# Altium schematic sheet MODULE_SCH.SchDoc
size A4; SheetNumber: 3; SheetTotal: 3
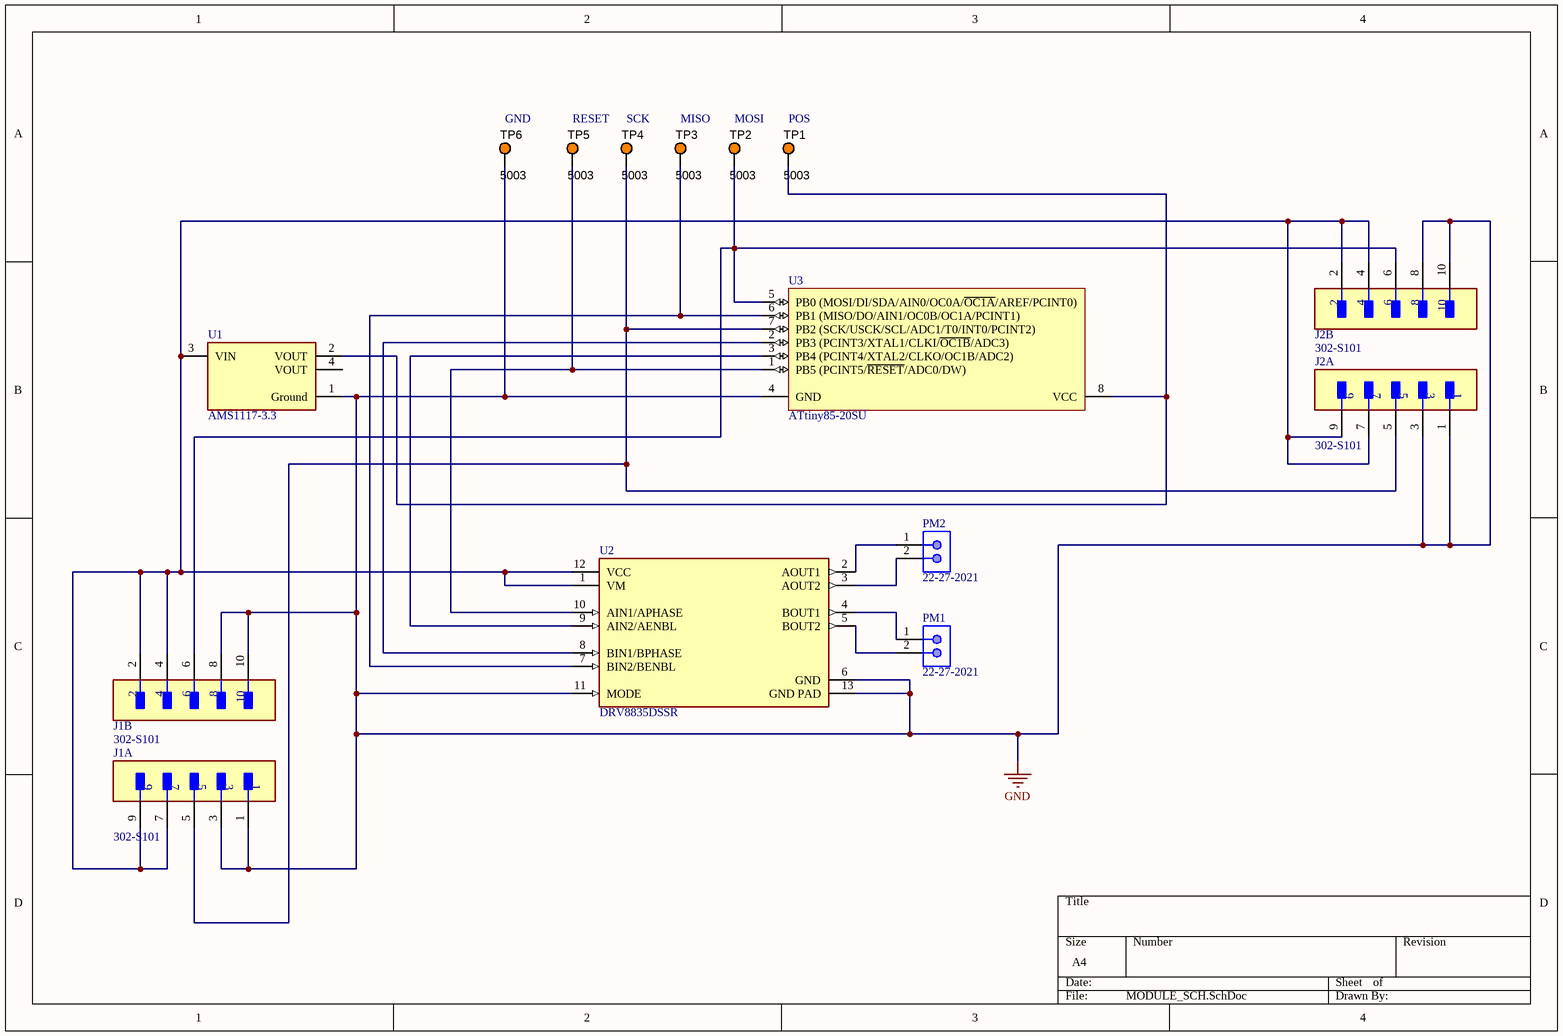
[diagram p0: MODULE_SCH.SchDoc]

## Parts
J1  302-S101  [FP-302-S101-MFG]  (parts A,B of 2)
J2  302-S101  [FP-302-S101-MFG]  (parts A,B of 2)
PM1  22-27-2021  [MOLX-22-27-2021_V]
PM2  22-27-2021  [MOLX-22-27-2021_V]
TP1  5003  [KSTN-5003]
TP2  5003  [KSTN-5003]
TP3  5003  [KSTN-5003]
TP4  5003  [KSTN-5003]
TP5  5003  [KSTN-5003]
TP6  5003  [KSTN-5003]
U1  AMS1117-3.3  [FP-AMS1117-IPC_C]
U2  DRV8835DSSR  [FP-DSS0012A-MFG]
U3  ATtiny85-20SU  [8S2_M]

## Nets
GND: J1.1 J1.3 J1.8 J1.10 J2.1 J2.3 J2.8 J2.10 TP6.1 U1.1(Ground) U2.6(GND) U2.11(MODE) U2.13(GND_PAD) U3.4(GND)
NetJ1_2: J1.2 J1.4 J1.7 J1.9 J2.2 J2.4 J2.7 J2.9 U1.3(VIN) U2.1(VM) U2.12(VCC)
NetJ1_5: J1.5 J2.5 TP4.1 U3.7(PB2_(SCK/USCK/SCL/ADC1/T0/INT0/PCINT2))
NetJ1_6: J1.6 J2.6 TP2.1 U3.5(PB0_(MOSI/DI/SDA/AIN0/OC0A/~{OC1A}/AREF/PCINT0))
NetPM1_1: PM1.1 U2.4(BOUT1)
NetPM1_2: PM1.2 U2.5(BOUT2)
NetPM2_1: PM2.1 U2.2(AOUT1)
NetPM2_2: PM2.2 U2.3(AOUT2)
NetTP1_1: TP1.1 U1.2(VOUT) U3.8(VCC)
NetTP3_1: TP3.1 U2.7(BIN2/BENBL) U3.6(PB1_(MISO/DO/AIN1/OC0B/OC1A/PCINT1))
NetTP5_1: TP5.1 U2.10(AIN1/APHASE) U3.1(PB5_(PCINT5/~{RESET}/ADC0/DW))
NetU2_8: U2.8(BIN1/BPHASE) U3.2(PB3_(PCINT3/XTAL1/CLKI/~{OC1B}/ADC3))
NetU2_9: U2.9(AIN2/AENBL) U3.3(PB4_(PCINT4/XTAL2/CLKO/OC1B/ADC2))

Not connected (* = marked no-connect by the designer): U1 4(VOUT)

## Notes on the sheet
- (near TP6) GND
- RESET
- (near TP4) SCK
- MISO
- MOSI
- (near TP1) POS

## Library data of the parts
J1 J2 = CMP-15228-000002-1: CONN HEADER VERT 10POS 2.54MM; Voltage Rating: 250V; Row Spacing: 0.1inch; Number of Positions: 10; Mount: Through Hole; Series: 302; Contact Type: Male Pin; Contact Plating: Gold; Contact Material: Brass; Number of Rows: 2; Color: Black; Contact Finish - Mating: GOLD; Packaging: Bulk; Pitch: 0.1inch; Fastening Type: Pull; Insulation Color: Black; Termination: Solder; Flammability Rating: UL94 V-0; Connector Type: Header; Max Operating Temperature: 105°C; Insulation Material: Glass; Contact Shape: Square; Min Operating Temperature: -40°C
PM1 PM2 = CMP-2000-05537-1: Male Header, Pitch 2.54 mm, 1 x 2 Position, Height 11.7 mm, Tail Length 3.56 mm, 0 to 75 degC, RoHS, Bulk; Manufacturer: Molex; PartNumber: 0022272021; Current rating: 4A; Package Version: Rev. BC, 02/2012; Voltage rating: 250V; No. of Positions: 2; Pitch: 2.54mm; No. of Rows: 1; Orientation: Vertical; Operating temperature: 0°Cto+75°C; Manufacturer URL: http://www.molex.com/; Mounting Technology: ThroughHole; Housing material: Nylon(UL94V-0); Package Description: 2-Leads Header, Body 5.08 x 5.8 mm, Pitch 2.54 mm; Voltage - Max: 250V; Datasheet URL: http://www.molex.com/pdm_docs/sd/022272021_sd.pdf; Package Reference: 22-27-2021; Contact material: Tinplatedbrass; Current - Max: 4A; Datasheet Version: Rev. F, 06/2009
TP1-TP6 = CMP-1672-00009-1: Test Point, Orange, 1-Pin THD, RoHS; Peak Reverse Current: 600 uA; Forward Current: 3 A; Max Surge Current: 80 A; Forward Voltage: 1.08 V; Max Operating Temperature: 150 degC; PackageReference: 5003; Pins: 2; ComponentLink2URL: http://keyelco.com/userAssets/file/M65p56.pdf; PackageDescription: 1-Pin Through Hole Device, Dia 2.54 mm; Weight: 0.01 lb; Diameter: 5.3 mm; Mount: Through Hole; Package Quantity: 500; Packaging: Bulk; Min Operating Temperature: -65 degC; ComponentLink1Description: Manufacturer URL; Height: 0.25 inch; ComponentLink1URL: http://www.keyelco.com/; ComponentLink2Description: Datasheet; Width: 0.25 inch; REACH SVHC: No SVHC; RoHSCompliant: true; Radiation Hardening: No; Length: 9.5 mm; DatasheetVersion: Jun-15
U1 = CMP-209535-000001-1: LDO Voltage Regulators 1A, 3.3V; Manufacturer: Advanced Monolithic Systems; Dropout Voltage: 1.1V; Output Type: Fixed; Nominal Supply Current: 5mA; Max Power Dissipation: 1.2W; Max Supply Voltage: 15V; Number Of Outputs: 1; Standoff Height: 0.64mm; Max Junction Temp: +125°C; Height: 1.8mm; Package: AMS1117; Device Class L2: Power Management ICs; ComponentLink2Description: Datasheet; ComponentLink2URL: http://www.advanced-monolithic.com/pdf/ds1117.pdf; Category: IC; RoHS: TRUE; Automotive: No; Device Class L1: Integrated Circuits (ICs); Output Current: 1A; Device Class L3: Voltage Regulators - Linear; Temperature: -40°C to +125°C; Output Voltage: 3.3V; Manufacturer Part Number: AMS1117-3.3; Temperature Range Low: -40°C; Octopart: https://octopart.com/ams1117-3.3-advanced+monolithic+systems-25899300; Lead Free: Yes; Ipc Land Pattern Name: SOT229P700X180-4; Temperature Range High: +125°C
U2 = CMP-04915-000062-1: IC MTR DRVR BIPOLAR 2-7V 12WSON; Switching Frequency: 250kHz; Output Current: 1.5A; Motor Type: Stepper; Interface: Parallel; Collector Emitter Voltage (VCEO): 11V; Logic Function: AND GATE; Drain to Source Resistance: 305mR; Number of Outputs: 2; Min Supply Voltage: 2V; Max Supply Voltage: 7V; Height: 0.75mm; Radiation Hardening: No; Package Quantity: 3000; Max Collector Current: 1.5A; Number of Pins: 12; Length: 3.1mm; Min Operating Temperature: -40°C; Series: DRV8835; Mount: Surface Mount; Lead Free: Lead Free; Width: 2.1mm; REACH SVHC: No SVHC; Output Voltage: 11V; Case/Package: SON; Packaging: Tape and Reel; Max Operating Temperature: 85°C; Operating Supply Current: 1.5A; RoHS Compliant: Yes
U3 = CMP-0093-00173-2: 8-bit AVR Microcontroller, 20MHz, 2.7-5.5V, 8K Flash, 512 Bytes EEPROM, 512 Bytes SRAM, Industrial Grade (-40°C to 85°C), 8-Lead SOIC, Pb-Free; ComponentLink3Description: ATtiny25/45/85 Summary; DatasheetVersion: revN, Apr-2011; PackageVersion: revF, Apr-2008; ComponentLink3URL: http://www.atmel.com/dyn/resources/prod_documents/2586S.pdf; ComponentLink1URL: http://www.atmel.com/; ComponentLink2Description: ATtiny25/45/85 Datasheet; RevisionNote: DatasheetVersion updated. URLs added.; PackageDescription: 8-Lead, 0.208" Body, Plastic Small Outline Package (EIAJ); ComponentLink1Description: Manufacturer URL; PackageReference: 8S2; ComponentLink2URL: http://www.atmel.com/dyn/resources/prod_documents/doc2586.pdf